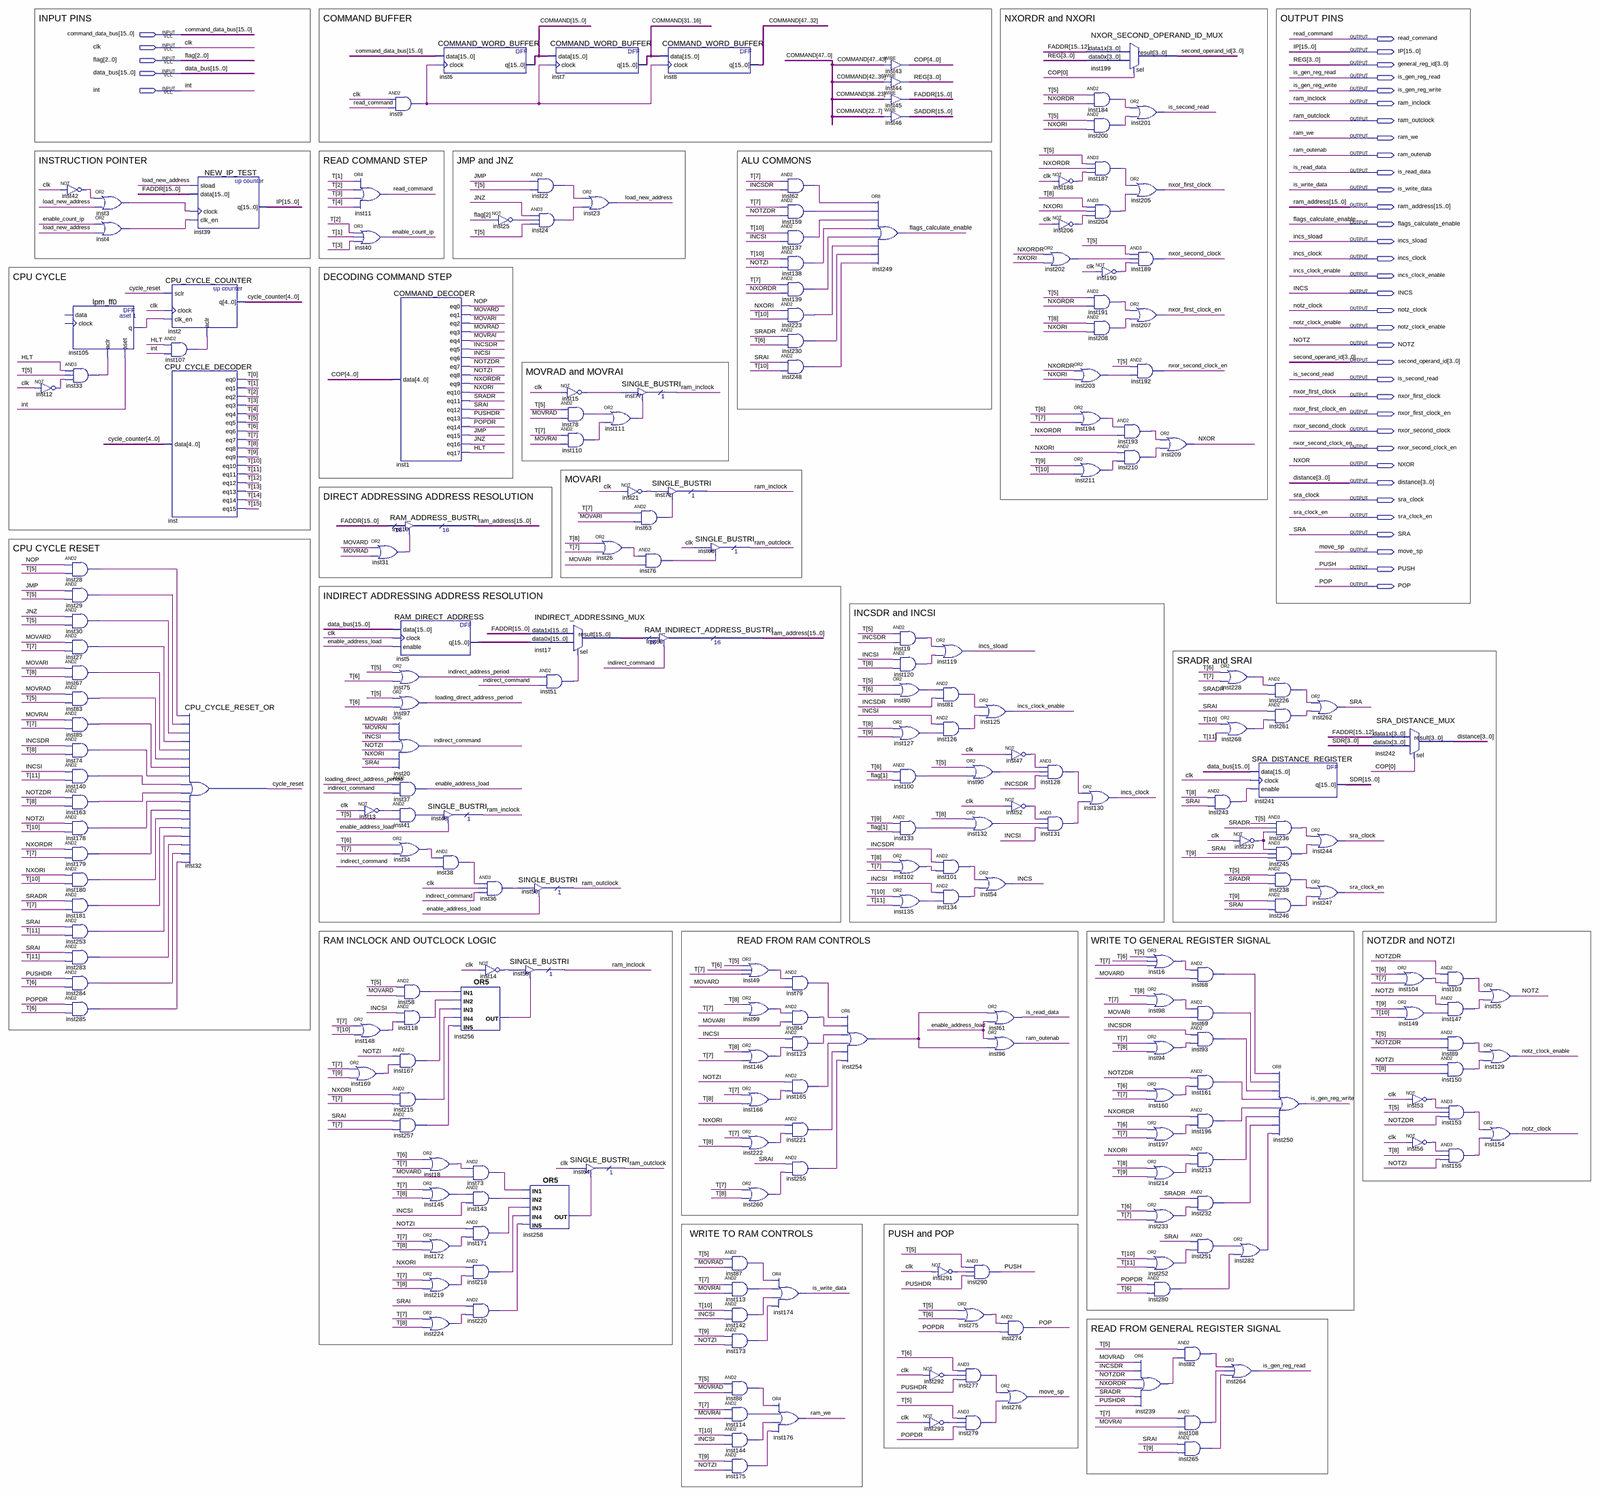
[diagram p0: schematic sheet, whole]
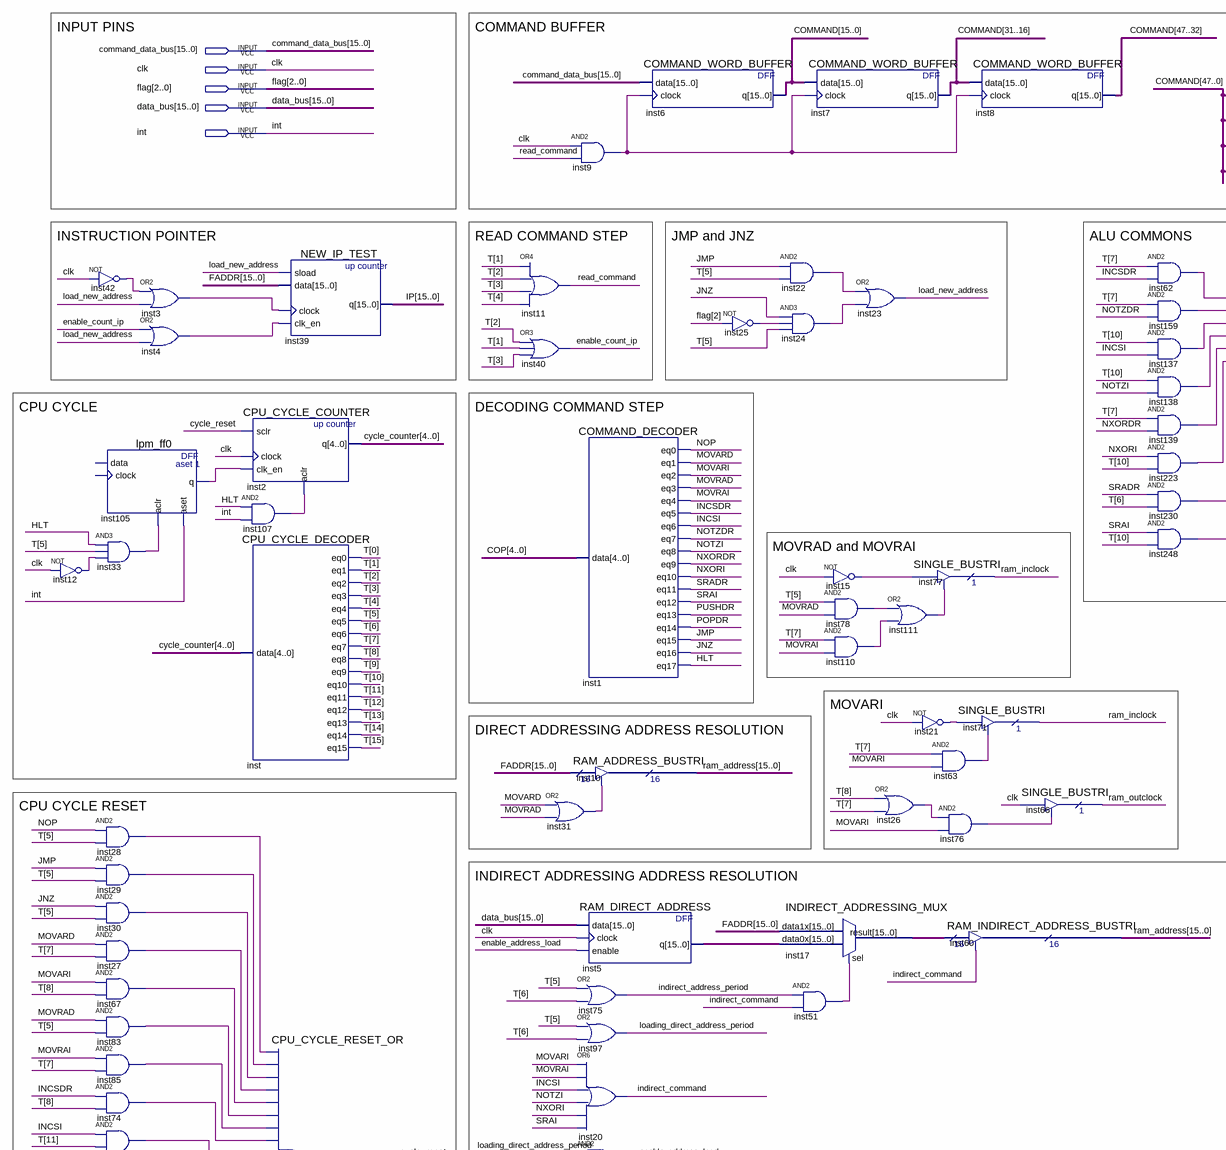
[diagram p1: schematic sheet, upper left part]
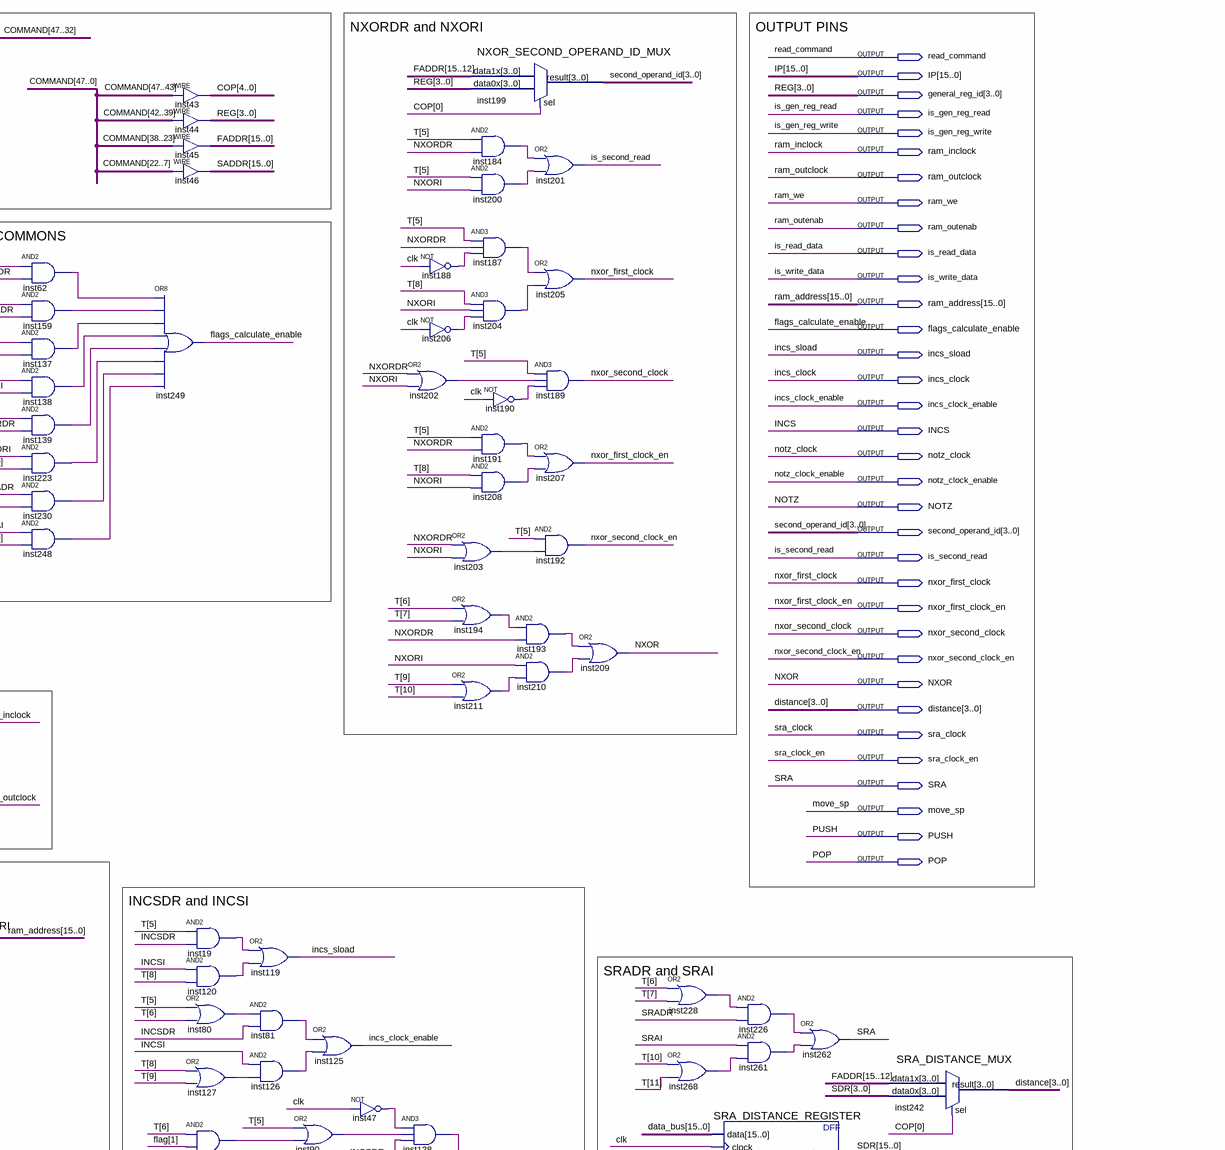
[diagram p2: schematic sheet, upper right part]
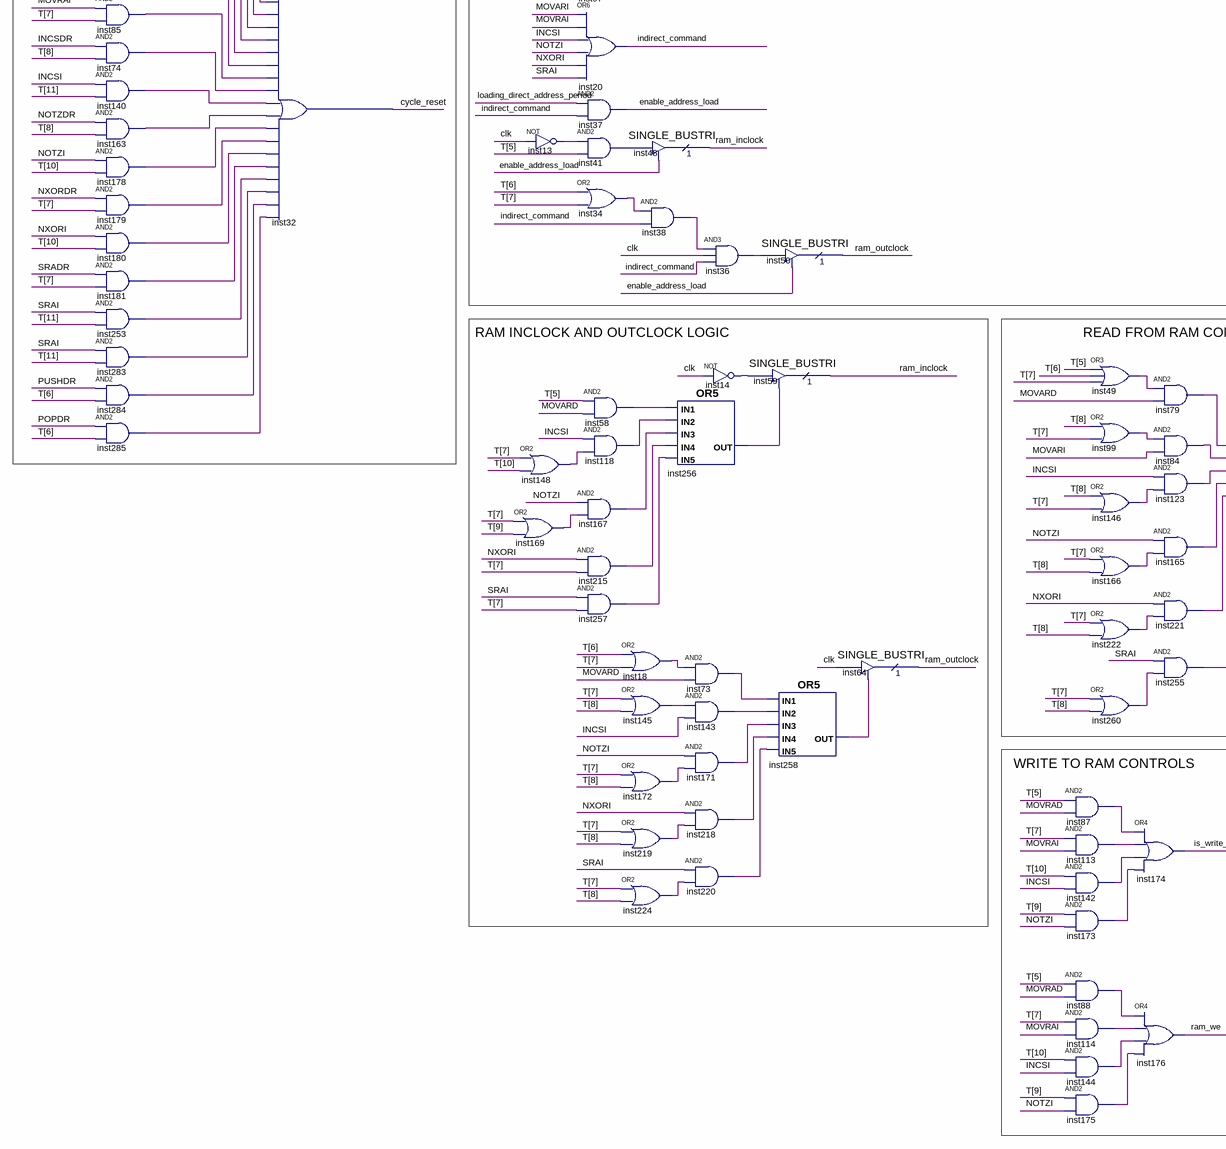
[diagram p3: schematic sheet, lower left part]
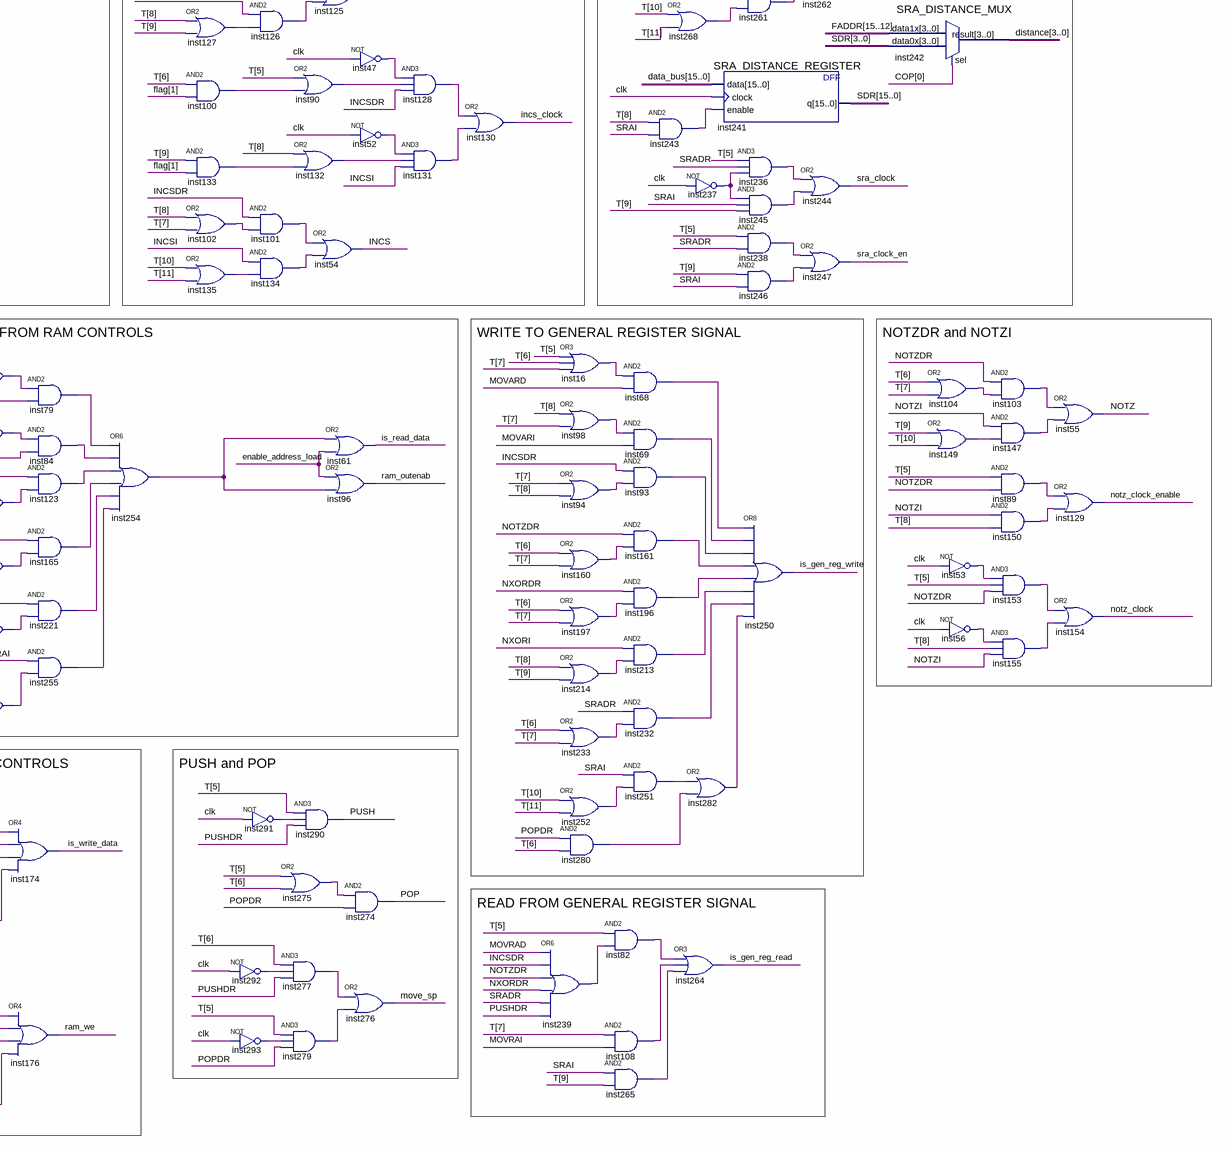
[diagram p4: schematic sheet, lower right part]
// Quartus schematic CONTROL_DEVICE.bdf as structural Verilog: 233 symbols, 39 pins
module CONTROL_DEVICE (
  input  [15:0] command_data_bus,
  input  clk,
  input  [2:0] flag,
  input  [15:0] data_bus,
  input  \int ,
  output read_command,
  output [15:0] IP,
  output [3:0] general_reg_id,
  output is_gen_reg_read,
  output is_gen_reg_write,
  output ram_inclock,
  output ram_outclock,
  output ram_we,
  output ram_outenab,
  output is_read_data,
  output is_write_data,
  output [15:0] ram_address,
  output flags_calculate_enable,
  output incs_sload,
  output incs_clock,
  output incs_clock_enable,
  output INCS,
  output notz_clock,
  output notz_clock_enable,
  output NOTZ,
  output [3:0] second_operand_id,
  output is_second_read,
  output nxor_first_clock,
  output nxor_first_clock_en,
  output nxor_second_clock,
  output nxor_second_clock_en,
  output NXOR,
  output [3:0] distance,
  output sra_clock,
  output sra_clock_en,
  output SRA,
  output move_sp,
  output PUSH,
  output POP
);

  wire cycle_reset, enable_address_load, enable_count_ip, HLT, INCSDR, INCSI, indirect_address_period,
       indirect_command, inst3_out, inst4_out, inst9_out, inst12_out, inst13_out, inst14_out, inst15_out,
       inst16_out, inst18_out, inst19_out, inst21_out, inst22_out, inst24_out, inst25_out, inst26_out,
       inst27_out, inst28_out, inst29_out, inst30_out, inst31_out, inst33_out, inst34_out, inst36_out,
       inst38_out, inst41_out, inst42_out, inst47_out, inst49_out, inst51_out, inst52_out, inst53_out,
       inst56_out, inst58_out, inst62_out, inst63_out, inst67_out, inst68_out, inst69_out, inst73_out,
       inst74_out, inst76_out, inst78_out, inst79_out, inst80_out, inst81_out, inst82_out, inst83_out,
       inst84_out, inst85_out, inst87_out, inst88_out, inst89_out, inst90_out, inst93_out, inst94_out,
       inst98_out, inst99_out, inst100_out, inst101_out, inst102_out, inst103_out, inst104_out, inst105_q,
       inst107_out, inst108_out, inst110_out, inst111_out, inst113_out, inst114_out, inst118_out,
       inst120_out, inst123_out, inst126_out, inst127_out, inst128_out, inst131_out, inst132_out,
       inst133_out, inst134_out, inst135_out, inst137_out, inst138_out, inst139_out, inst140_out,
       inst142_out, inst143_out, inst144_out, inst145_out, inst146_out, inst147_out, inst148_out,
       inst149_out, inst150_out, inst153_out, inst155_out, inst159_out, inst160_out, inst161_out,
       inst163_out, inst165_out, inst166_out, inst167_out, inst169_out, inst171_out, inst172_out,
       inst173_out, inst175_out, inst178_out, inst179_out, inst180_out, inst181_out, inst184_out,
       inst187_out, inst188_out, inst190_out, inst191_out, inst193_out, inst194_out, inst196_out,
       inst197_out, inst200_out, inst202_out, inst203_out, inst204_out, inst206_out, inst208_out,
       inst210_out, inst211_out, inst213_out, inst214_out, inst215_out, inst218_out, inst219_out,
       inst220_out, inst221_out, inst222_out, inst223_out, inst224_out, inst226_out, inst228_out,
       inst230_out, inst232_out, inst233_out, inst236_out, inst237_out, inst238_out, inst239_out,
       inst243_out, inst245_out, inst246_out, inst248_out, inst251_out, inst252_out, inst253_out,
       inst254_out, inst255_out, inst256_out, inst257_out, inst258_out, inst260_out, inst261_out,
       inst265_out, inst268_out, inst275_out, inst277_out, inst279_out, inst280_out, inst282_out,
       inst283_out, inst284_out, inst285_out, inst291_out, inst292_out, inst293_out, JMP, JNZ,
       load_new_address, loading_direct_address_period, MOVARD, MOVARI, MOVRAD, MOVRAI, NOP, NOTZDR, NOTZI,
       NXORDR, NXORI, POPDR, PUSHDR, SRADR, SRAI;
  wire [4:0] COP, cycle_counter;
  wire [15:0] FADDR, inst5_q, inst17_result, SADDR, SDR, T;
  wire [47:0] COMMAND;

  not inst42 (inst42_out, clk);
  lpm_ff0 inst105 (.aclr(inst33_out), .aset(\int ), .q(inst105_q));  // open: data, clock
  and inst33 (inst33_out, HLT, T[5], inst12_out);
  not inst12 (inst12_out, clk);
  and inst28 (inst28_out, NOP, T[5]);
  and inst29 (inst29_out, JMP, T[5]);
  and inst30 (inst30_out, JNZ, T[5]);
  and inst27 (inst27_out, MOVARD, T[7]);
  and inst67 (inst67_out, MOVARI, T[8]);
  and inst83 (inst83_out, MOVRAD, T[5]);
  and inst85 (inst85_out, MOVRAI, T[7]);
  and inst74 (inst74_out, INCSDR, T[8]);
  and inst140 (inst140_out, INCSI, T[11]);
  and inst163 (inst163_out, NOTZDR, T[8]);
  and inst178 (inst178_out, NOTZI, T[10]);
  and inst179 (inst179_out, NXORDR, T[7]);
  and inst180 (inst180_out, NXORI, T[10]);
  and inst181 (inst181_out, SRADR, T[7]);
  and inst253 (inst253_out, SRAI, T[11]);
  and inst283 (inst283_out, SRAI, T[11]);
  and inst284 (inst284_out, PUSHDR, T[6]);
  and inst285 (inst285_out, POPDR, T[6]);
  or inst3 (inst3_out, inst42_out, load_new_address);
  or inst4 (inst4_out, enable_count_ip, load_new_address);
  CPU_CYCLE_COUNTER inst2 (.sclr(cycle_reset), .clock(clk), .clk_en(inst105_q), .aclr(inst107_out), .q(cycle_counter));
  and inst107 (inst107_out, HLT, \int );
  CPU_CYCLE_DECODER inst (
    .data(cycle_counter), .eq0(T[0]), .eq1(T[1]), .eq2(T[2]), .eq3(T[3]), .eq4(T[4]), .eq5(T[5]), .eq6(T[6]),
    .eq7(T[7]), .eq8(T[8]), .eq9(T[9]), .eq10(T[10]), .eq11(T[11]), .eq12(T[12]), .eq13(T[13]), .eq14(T[14]),
    .eq15(T[15]));
  NEW_IP_TEST inst39 (.sload(load_new_address), .data(FADDR), .clock(inst3_out), .clk_en(inst4_out), .q(IP));
  CPU_CYCLE_RESET_OR inst32 (
    .data0(inst28_out), .data1(inst29_out), .data2(inst30_out), .data3(inst27_out), .data4(inst67_out),
    .data5(inst83_out), .data6(inst85_out), .data7(inst74_out), .data8(inst140_out), .data9(inst163_out),
    .data10(inst178_out), .data11(inst179_out), .data12(inst180_out), .data13(inst181_out),
    .data14(inst253_out), .data15(inst283_out), .data16(inst284_out), .data17(inst285_out),
    .result(cycle_reset));
  or inst11 (read_command, T[1], T[2], T[3], T[4]);
  or inst40 (enable_count_ip, T[2], T[1], T[3]);
  or inst31 (inst31_out, MOVARD, MOVRAD);
  not inst13 (inst13_out, clk);
  or inst148 (inst148_out, T[7], T[10]);
  or inst169 (inst169_out, T[7], T[9]);
  and inst9 (inst9_out, clk, read_command);
  COMMAND_DECODER inst1 (
    .data(COP), .eq0(NOP), .eq1(MOVARD), .eq2(MOVARI), .eq3(MOVRAD), .eq4(MOVRAI), .eq5(INCSDR), .eq6(INCSI),
    .eq7(NOTZDR), .eq8(NOTZI), .eq9(NXORDR), .eq10(NXORI), .eq11(SRADR), .eq12(SRAI), .eq13(PUSHDR),
    .eq14(POPDR), .eq15(JMP), .eq16(JNZ), .eq17(HLT));
  RAM_ADDRESS_BUSTRI inst10 (.enabledt(inst31_out), .data(FADDR), .tridata(ram_address));
  RAM_DIRECT_ADDRESS inst5 (.data(data_bus), .clock(clk), .enable(enable_address_load), .q(inst5_q));
  or inst75 (indirect_address_period, T[5], T[6]);
  or inst97 (loading_direct_address_period, T[5], T[6]);
  or inst20 (indirect_command, MOVARI, MOVRAI, INCSI, NOTZI, NXORI, SRAI);
  and inst37 (enable_address_load, loading_direct_address_period, indirect_command);
  and inst41 (inst41_out, inst13_out, T[5]);
  or inst34 (inst34_out, T[6], T[7]);
  and inst58 (inst58_out, T[5], MOVARD);
  and inst118 (inst118_out, INCSI, inst148_out);
  and inst167 (inst167_out, NOTZI, inst169_out);
  and inst215 (inst215_out, NXORI, T[7]);
  and inst257 (inst257_out, SRAI, T[7]);
  COMMAND_WORD_BUFFER inst6 (.data(command_data_bus), .clock(inst9_out), .q(COMMAND[15:0]));
  SINGLE_BUSTRI inst48 (.enabledt(enable_address_load), .data(inst41_out), .tridata(ram_inclock));
  and inst38 (inst38_out, inst34_out, indirect_command);
  or inst18 (inst18_out, T[6], T[7]);
  or inst145 (inst145_out, T[7], T[8]);
  or inst172 (inst172_out, T[7], T[8]);
  or inst219 (inst219_out, T[7], T[8]);
  or inst224 (inst224_out, T[7], T[8]);
  and inst36 (inst36_out, inst38_out, clk, indirect_command);
  not inst14 (inst14_out, clk);
  or inst256 (inst256_out, inst58_out, inst118_out, inst167_out, inst215_out, inst257_out);
  and inst73 (inst73_out, inst18_out, MOVARD);
  and inst143 (inst143_out, inst145_out, INCSI);
  and inst171 (inst171_out, NOTZI, inst172_out);
  and inst218 (inst218_out, NXORI, inst219_out);
  and inst220 (inst220_out, SRAI, inst224_out);
  not inst25 (inst25_out, flag[2]);
  SINGLE_BUSTRI inst59 (.enabledt(inst256_out), .data(inst14_out), .tridata(ram_inclock));
  COMMAND_WORD_BUFFER inst7 (.data(COMMAND[15:0]), .clock(inst9_out), .q(COMMAND[31:16]));
  and inst22 (inst22_out, JMP, T[5]);
  and inst24 (inst24_out, JNZ, inst25_out, T[5]);
  INDIRECT_ADDRESSING_MUX inst17 (.data1x(FADDR), .data0x(inst5_q), .sel(inst51_out), .result(inst17_result));
  and inst51 (inst51_out, indirect_address_period, indirect_command);
  SINGLE_BUSTRI inst50 (.enabledt(enable_address_load), .data(inst36_out), .tridata(ram_outclock));
  or inst258 (inst258_out, inst73_out, inst143_out, inst171_out, inst218_out, inst220_out);
  or inst23 (load_new_address, inst22_out, inst24_out);
  not inst15 (inst15_out, clk);
  and inst78 (inst78_out, T[5], MOVRAD);
  and inst110 (inst110_out, T[7], MOVRAI);
  SINGLE_BUSTRI inst64 (.enabledt(inst258_out), .data(clk), .tridata(ram_outclock));
  or inst111 (inst111_out, inst78_out, inst110_out);
  or inst26 (inst26_out, T[8], T[7]);
  SINGLE_BUSTRI inst77 (.enabledt(inst111_out), .data(inst15_out), .tridata(ram_inclock));
  SINGLE_BUSTRI inst71 (.enabledt(inst63_out), .data(inst21_out), .tridata(ram_inclock));
  not inst21 (inst21_out, clk);
  and inst63 (inst63_out, T[7], MOVARI);
  and inst76 (inst76_out, inst26_out, MOVARI);
  RAM_INDIRECT_ADDRESS_BUSTRI inst60 (.enabledt(indirect_command), .data(inst17_result), .tridata(ram_address));
  COMMAND_WORD_BUFFER inst8 (.data(COMMAND[31:16]), .clock(inst9_out), .q(COMMAND[47:32]));
  SINGLE_BUSTRI inst66 (.enabledt(inst76_out), .data(clk), .tridata(ram_outclock));
  or inst49 (inst49_out, T[5], T[6], T[7]);
  or inst99 (inst99_out, T[8], T[7]);
  or inst146 (inst146_out, T[8], T[7]);
  or inst166 (inst166_out, T[7], T[8]);
  or inst222 (inst222_out, T[7], T[8]);
  or inst260 (inst260_out, T[7], T[8]);
  and inst87 (inst87_out, T[5], MOVRAD);
  and inst113 (inst113_out, T[7], MOVRAI);
  and inst142 (inst142_out, T[10], INCSI);
  and inst173 (inst173_out, T[9], NOTZI);
  and inst88 (inst88_out, T[5], MOVRAD);
  and inst114 (inst114_out, T[7], MOVRAI);
  and inst144 (inst144_out, T[10], INCSI);
  and inst175 (inst175_out, T[9], NOTZI);
  and inst62 (inst62_out, T[7], INCSDR);
  and inst159 (inst159_out, T[7], NOTZDR);
  and inst137 (inst137_out, T[10], INCSI);
  and inst138 (inst138_out, T[10], NOTZI);
  and inst139 (inst139_out, T[7], NXORDR);
  and inst223 (inst223_out, NXORI, T[10]);
  and inst230 (inst230_out, SRADR, T[6]);
  and inst248 (inst248_out, SRAI, T[10]);
  and inst79 (inst79_out, inst49_out, MOVARD);
  and inst84 (inst84_out, inst99_out, MOVARI);
  and inst123 (inst123_out, INCSI, inst146_out);
  and inst165 (inst165_out, NOTZI, inst166_out);
  and inst221 (inst221_out, NXORI, inst222_out);
  and inst255 (inst255_out, SRAI, inst260_out);
  or inst174 (is_write_data, inst87_out, inst113_out, inst142_out, inst173_out);
  or inst176 (ram_we, inst88_out, inst114_out, inst144_out, inst175_out);
  or inst254 (inst254_out, inst79_out, inst84_out, inst123_out, inst165_out, inst221_out, inst255_out);
  assign COP = COMMAND[47:43];  // WIRE inst43
  assign general_reg_id = COMMAND[42:39];  // WIRE inst44
  assign FADDR = COMMAND[38:23];  // WIRE inst45
  assign SADDR = COMMAND[22:7];  // WIRE inst46
  or inst249 (flags_calculate_enable, inst62_out, inst159_out, inst137_out, inst138_out, inst139_out, inst223_out, inst230_out, inst248_out);
  and inst19 (inst19_out, T[5], INCSDR);
  and inst120 (inst120_out, INCSI, T[8]);
  or inst80 (inst80_out, T[5], T[6]);
  or inst127 (inst127_out, T[8], T[9]);
  and inst100 (inst100_out, T[6], flag[1]);
  and inst133 (inst133_out, T[9], flag[1]);
  or inst102 (inst102_out, T[8], T[7]);
  or inst135 (inst135_out, T[10], T[11]);
  not inst292 (inst292_out, clk);
  not inst293 (inst293_out, clk);
  or inst119 (incs_sload, inst19_out, inst120_out);
  and inst81 (inst81_out, inst80_out, INCSDR);
  and inst126 (inst126_out, INCSI, inst127_out);
  and inst101 (inst101_out, INCSDR, inst102_out);
  and inst134 (inst134_out, INCSI, inst135_out);
  not inst291 (inst291_out, clk);
  or inst275 (inst275_out, T[5], T[6]);
  and inst277 (inst277_out, T[6], inst292_out, PUSHDR);
  and inst279 (inst279_out, T[5], inst293_out, POPDR);
  or inst125 (incs_clock_enable, inst81_out, inst126_out);
  or inst90 (inst90_out, T[5], inst100_out);
  or inst132 (inst132_out, T[8], inst133_out);
  or inst54 (INCS, inst101_out, inst134_out);
  or inst61 (is_read_data, inst254_out, enable_address_load);
  or inst96 (ram_outenab, enable_address_load, inst254_out);
  and inst290 (PUSH, T[5], inst291_out, PUSHDR);
  not inst47 (inst47_out, clk);
  not inst52 (inst52_out, clk);
  and inst274 (POP, inst275_out, POPDR);
  or inst276 (move_sp, inst277_out, inst279_out);
  not inst188 (inst188_out, clk);
  not inst206 (inst206_out, clk);
  or inst202 (inst202_out, NXORDR, NXORI);
  and inst128 (inst128_out, inst47_out, inst90_out, INCSDR);
  and inst131 (inst131_out, inst52_out, inst132_out, INCSI);
  NXOR_SECOND_OPERAND_ID_MUX inst199 (
    .data1x(FADDR[15:12]), .data0x(general_reg_id), .sel(COP[0]), .result(second_operand_id));
  and inst184 (inst184_out, T[5], NXORDR);
  and inst200 (inst200_out, T[5], NXORI);
  and inst187 (inst187_out, T[5], NXORDR, inst188_out);
  and inst204 (inst204_out, T[8], NXORI, inst206_out);
  not inst190 (inst190_out, clk);
  and inst191 (inst191_out, T[5], NXORDR);
  and inst208 (inst208_out, T[8], NXORI);
  or inst203 (inst203_out, NXORDR, NXORI);
  or inst194 (inst194_out, T[6], T[7]);
  or inst211 (inst211_out, T[9], T[10]);
  or inst130 (incs_clock, inst128_out, inst131_out);
  or inst201 (is_second_read, inst184_out, inst200_out);
  or inst205 (nxor_first_clock, inst187_out, inst204_out);
  and inst189 (nxor_second_clock, T[5], inst202_out, inst190_out);
  or inst207 (nxor_first_clock_en, inst191_out, inst208_out);
  and inst192 (nxor_second_clock_en, T[5], inst203_out);
  and inst193 (inst193_out, inst194_out, NXORDR);
  and inst210 (inst210_out, NXORI, inst211_out);
  or inst239 (inst239_out, MOVRAD, INCSDR, NOTZDR, NXORDR, SRADR, PUSHDR);
  or inst209 (NXOR, inst193_out, inst210_out);
  or inst16 (inst16_out, T[5], T[6], T[7]);
  or inst98 (inst98_out, T[8], T[7]);
  or inst94 (inst94_out, T[7], T[8]);
  or inst160 (inst160_out, T[6], T[7]);
  or inst197 (inst197_out, T[6], T[7]);
  or inst214 (inst214_out, T[8], T[9]);
  or inst233 (inst233_out, T[6], T[7]);
  or inst252 (inst252_out, T[10], T[11]);
  and inst280 (inst280_out, POPDR, T[6]);
  and inst68 (inst68_out, inst16_out, MOVARD);
  and inst69 (inst69_out, inst98_out, MOVARI);
  and inst93 (inst93_out, INCSDR, inst94_out);
  and inst161 (inst161_out, NOTZDR, inst160_out);
  and inst196 (inst196_out, NXORDR, inst197_out);
  and inst213 (inst213_out, NXORI, inst214_out);
  and inst232 (inst232_out, SRADR, inst233_out);
  and inst251 (inst251_out, SRAI, inst252_out);
  and inst82 (inst82_out, T[5], inst239_out);
  and inst108 (inst108_out, T[7], MOVRAI);
  and inst265 (inst265_out, SRAI, T[9]);
  or inst228 (inst228_out, T[6], T[7]);
  or inst268 (inst268_out, T[10], T[11]);
  and inst243 (inst243_out, T[8], SRAI);
  not inst237 (inst237_out, clk);
  or inst282 (inst282_out, inst251_out, inst280_out);
  or inst264 (is_gen_reg_read, inst82_out, inst108_out, inst265_out);
  and inst226 (inst226_out, inst228_out, SRADR);
  and inst261 (inst261_out, SRAI, inst268_out);
  SRA_DISTANCE_REGISTER inst241 (.data(data_bus), .clock(clk), .enable(inst243_out), .q(SDR));
  and inst236 (inst236_out, T[5], SRADR, inst237_out);
  and inst245 (inst245_out, inst237_out, SRAI, T[9]);
  and inst238 (inst238_out, T[5], SRADR);
  and inst246 (inst246_out, T[9], SRAI);
  or inst250 (is_gen_reg_write, inst68_out, inst69_out, inst93_out, inst161_out, inst196_out, inst213_out, inst232_out, inst282_out);
  or inst262 (SRA, inst226_out, inst261_out);
  or inst244 (sra_clock, inst236_out, inst245_out);
  or inst247 (sra_clock_en, inst238_out, inst246_out);
  SRA_DISTANCE_MUX inst242 (.data1x(FADDR[15:12]), .data0x(SDR[3:0]), .sel(COP[0]), .result(distance));
  or inst104 (inst104_out, T[6], T[7]);
  or inst149 (inst149_out, T[9], T[10]);
  not inst53 (inst53_out, clk);
  not inst56 (inst56_out, clk);
  and inst103 (inst103_out, NOTZDR, inst104_out);
  and inst147 (inst147_out, NOTZI, inst149_out);
  and inst89 (inst89_out, T[5], NOTZDR);
  and inst150 (inst150_out, NOTZI, T[8]);
  and inst153 (inst153_out, inst53_out, T[5], NOTZDR);
  and inst155 (inst155_out, inst56_out, T[8], NOTZI);
  or inst55 (NOTZ, inst103_out, inst147_out);
  or inst129 (notz_clock_enable, inst89_out, inst150_out);
  or inst154 (notz_clock, inst153_out, inst155_out);

  // Other names for the same wires on the sheet: REG[3:0] = general_reg_id

  // Notes on the sheet:
  //   INPUT PINS
  //   COMMAND BUFFER
  //   NXORDR and NXORI
  //   OUTPUT PINS
  //   INSTRUCTION POINTER
  //   READ COMMAND STEP
  //   JMP and JNZ
  //   ALU COMMONS
  //   CPU CYCLE
  //   DECODING COMMAND STEP
  //   MOVRAD and MOVRAI
  //   MOVARI
  //   DIRECT ADDRESSING ADDRESS RESOLUTION
  //   CPU CYCLE RESET
  //   INDIRECT ADDRESSING ADDRESS RESOLUTION
  //   INCSDR and INCSI
  //   SRADR and SRAI
  //   RAM INCLOCK AND OUTCLOCK LOGIC
  //   READ FROM RAM CONTROLS
  //   WRITE TO GENERAL REGISTER SIGNAL
  //   NOTZDR and NOTZI
  //   WRITE TO RAM CONTROLS
  //   PUSH and POP
  //   READ FROM GENERAL REGISTER SIGNAL
endmodule
